# Altium schematic sheet Power.SchDoc
size A4; DocumentNumber: 4; SheetNumber: 4; SheetTotal: 4
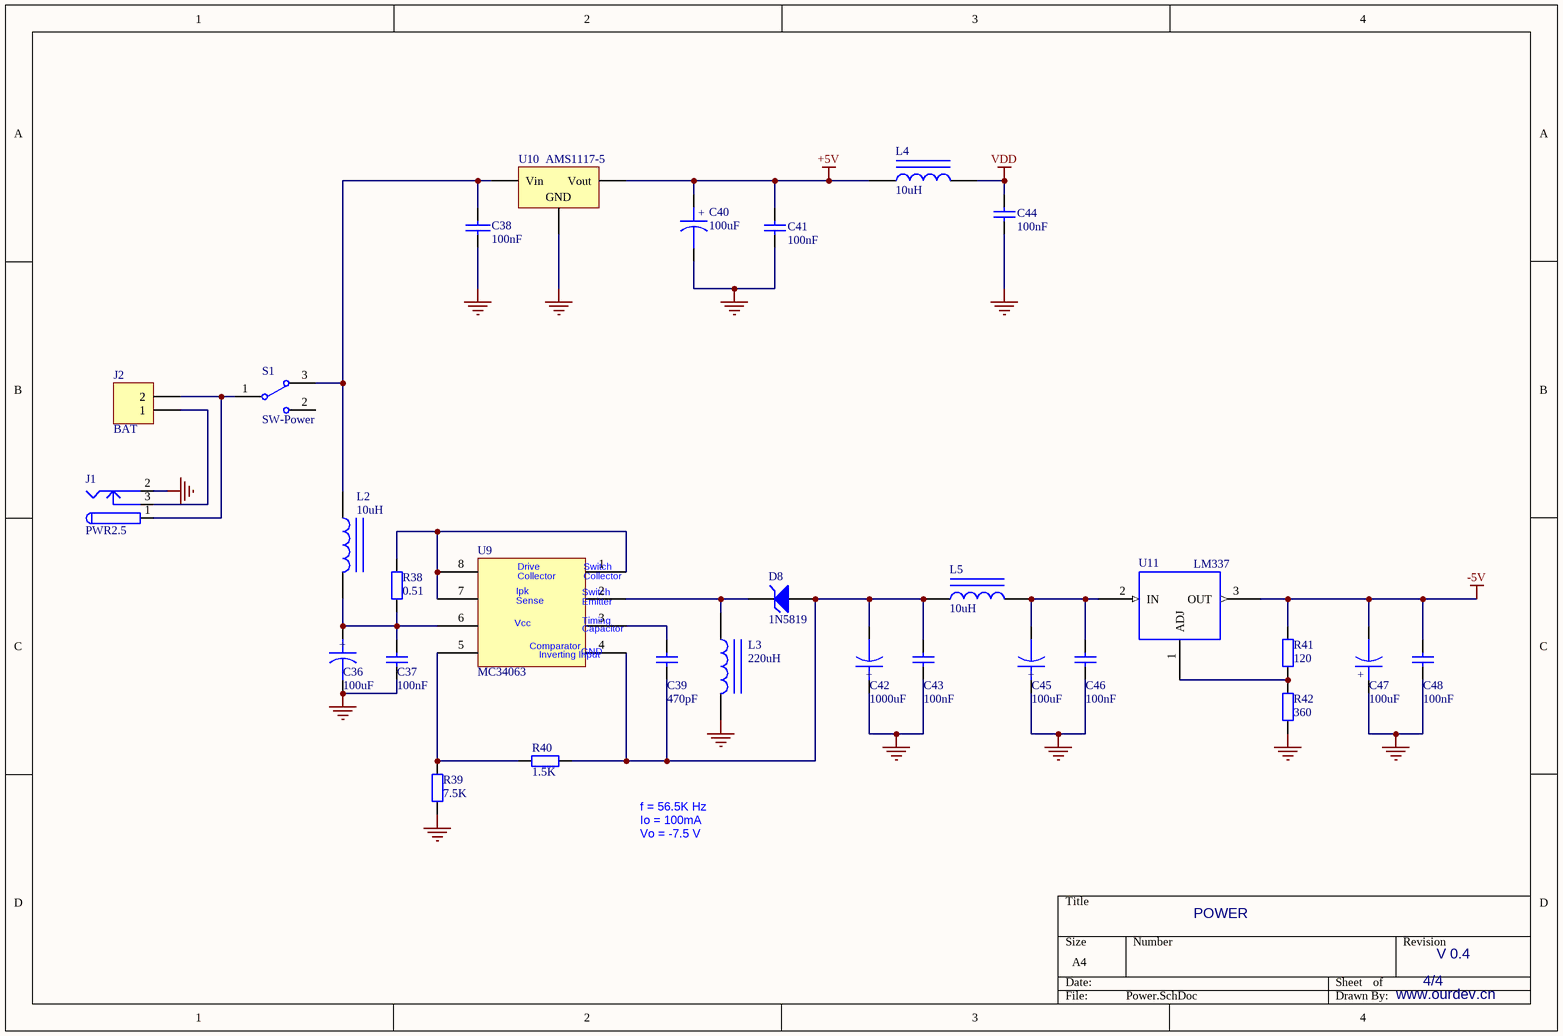
[diagram p0: Power.SchDoc]

## Parts
C36  100uF  [Cap 3X6]
C37  100nF  [CC2012-0805]
C38  100nF  [CC2012-0805]
C39  470pF  [CC2012-0805]
C40  100uF  [Cap 3X6]
C41  100nF  [CC2012-0805]
C42  1000uF  [Cap 3X6]
C43  100nF  [CC2012-0805]
C44  100nF  [CC2012-0805]
C45  100uF  [Cap 3X6]
C46  100nF  [CC2012-0805]
C47  100uF  [Cap 3X6]
C48  100nF  [CC2012-0805]
D8  1N5819  [SMC]
J1  PWR2.5  [DC JACK]
J2  BAT  [HDR1X2]
L2  10uH  [L1.4/3]
L3  220uH  [L1.4/3]
L4  10uH  [L1.4/3]
L5  10uH  [L1.4/3]
R38  0.51  [R-1206]
R39  7.5K  [CR2012-0805]
R40  1.5K  [CR2012-0805]
R41  120  [CR2012-0805]
R42  360  [CR2012-0805]
S1  SW-Power  [SW-6B]
U9  MC34063  [SO-8]
U10  AMS1117-5  [SOT-223]
U11  LM337  [D2PAK]

## Nets
+5V: C40.1 C41.1 L4.1 U10.2(Vout)
-5V: C47.2 C48.1 R41.2 U11.3(OUT)
GND: C36.2 C37.2 C38.2 C40.2 C41.2 C42.1 C43.2 C44.2 C45.1 C46.2 C47.1 C48.2 J1.2 L3.2 R39.1 R42.1 U10.1(GND)
VDD: C44.1 L4.2
NetC36_1: C36.1 C37.1 L2.2 R38.1 U9.6
NetC38_1: C38.1 L2.1 S1.3 U10.3(Vin)
NetC39_1: C39.1 U9.3
NetC39_2: C39.2 C42.2 C43.1 D8.1(A) L5.1 R40.2 U9.4
NetC45_2: C45.2 C46.1 L5.2 U11.2(IN)
NetD8_2: D8.2(K) L3.1 U9.2
NetJ1_1: J1.1 J2.2 S1.1
NetJ1_3: J1.3 J2.1
NetR38_2: R38.2 U9.1 U9.7 U9.8
NetR39_2: R39.2 R40.1 U9.5
NetR41_1: R41.1 R42.2 U11.1(ADJ)

Not connected (* = marked no-connect by the designer): S1 2

## Notes on the sheet
- f = 56.5K Hz
- Io = 100mA
- Vo = -7.5 V
- POWER
- 4/4
- V 0.4
- www.ourdev.cn
- (in symbol CAPACITOR POL) +
- (in symbol MC34063) Drive; Switch; Collector; Ipk; Sense; Emitter; Timing; Vcc; Capacitor; Comparator; Inverting Input; GND

## Library data of the parts
C36 C40 C42 C45 C47 = CAPACITOR POL: Capacitor
C37 C41 C43 C44 C46 C48 = Cap: Capacitor; Value: 10nF; Published: 8-Jun-2000; Revision: July-2002: Re-released for DXP Platform.; Publisher: Altium Limited
C38 = CAP: Capacitor
C39 = Cap: Capacitor; Published: 8-Jun-2000; Revision: July-2002: Re-released for DXP Platform.; Publisher: Altium Limited; Value: 470pF
D8 = D Zener: Zener Diode; Published: 8-Jun-2000; LatestRevisionDate: 17-Jul-2002; LatestRevisionNote: Re-released for DXP Platform.; PackageReference: DIODE-0.7; Publisher: Altium Limited
J1 = PWR2.5: Low Voltage Power Supply Connector; Published: 17-Dec-2003; DatasheetDocument: 09-May-2002; Publisher: Altium Limited; ComponentLink1Description: Manufacturer Link; ComponentLink1URL: http://domino.kycon.com/internet/Products.html
J2 = Header 2: Header, 2-Pin; LatestRevisionDate: 17-Jul-2002; LatestRevisionNote: Re-released for DXP Platform.; Publisher: Altium Limited
L2-L5 = Inductor Iron: Magnetic-Core Inductor; Published: 24-Mar-1999; LatestRevisionDate: 17-Jul-2002; LatestRevisionNote: Re-released for DXP Platform.; PackageReference: AXIAL-0.9; Publisher: Altium Limited
  L2 L4 L5: Value: 10uH
  L3: Value: 220uH
R38-R42 = Res2: Resistor; Published: 8-Jun-2000; LatestRevisionDate: 17-Jul-2002; LatestRevisionNote: Re-released for DXP Platform.; PackageReference: AXIAL-0.4; Publisher: Altium Limited
  R38: Value: 0.51
  R39: Value: 7.5K
  R40: Value: 1.5K
  R41: Value: 120
  R42: Value: 360
S1 = SW-SPDT: SPDT Subminiature Toggle Switch, Right Angle Mounting, Vertical Actuation; Published: 24-Mar-1999; LatestRevisionDate: 17-Dec-2003; LatestRevisionNote: Schematic revised, PCB Footprint replaced.; DatasheetDocument: 05-Dec-2000; PackageReference: TL36WW15050; Publisher: Altium Limited; ComponentLink1Description: Manufacturer Link; ComponentLink1URL: http://www.apem.com
U10 = Volt Reg: Voltage Regulator; Published: 24-Mar-1999; LatestRevisionDate: 17-Jul-2002; LatestRevisionNote: Re-released for DXP Platform.; PackageReference: D2PAK; Publisher: Altium Limited; Code_JEDEC: SMD-220